# EAGLE design Switch-0.8-5.5v-ds18b20-1-4Ch (EAGLE 8.2.1)
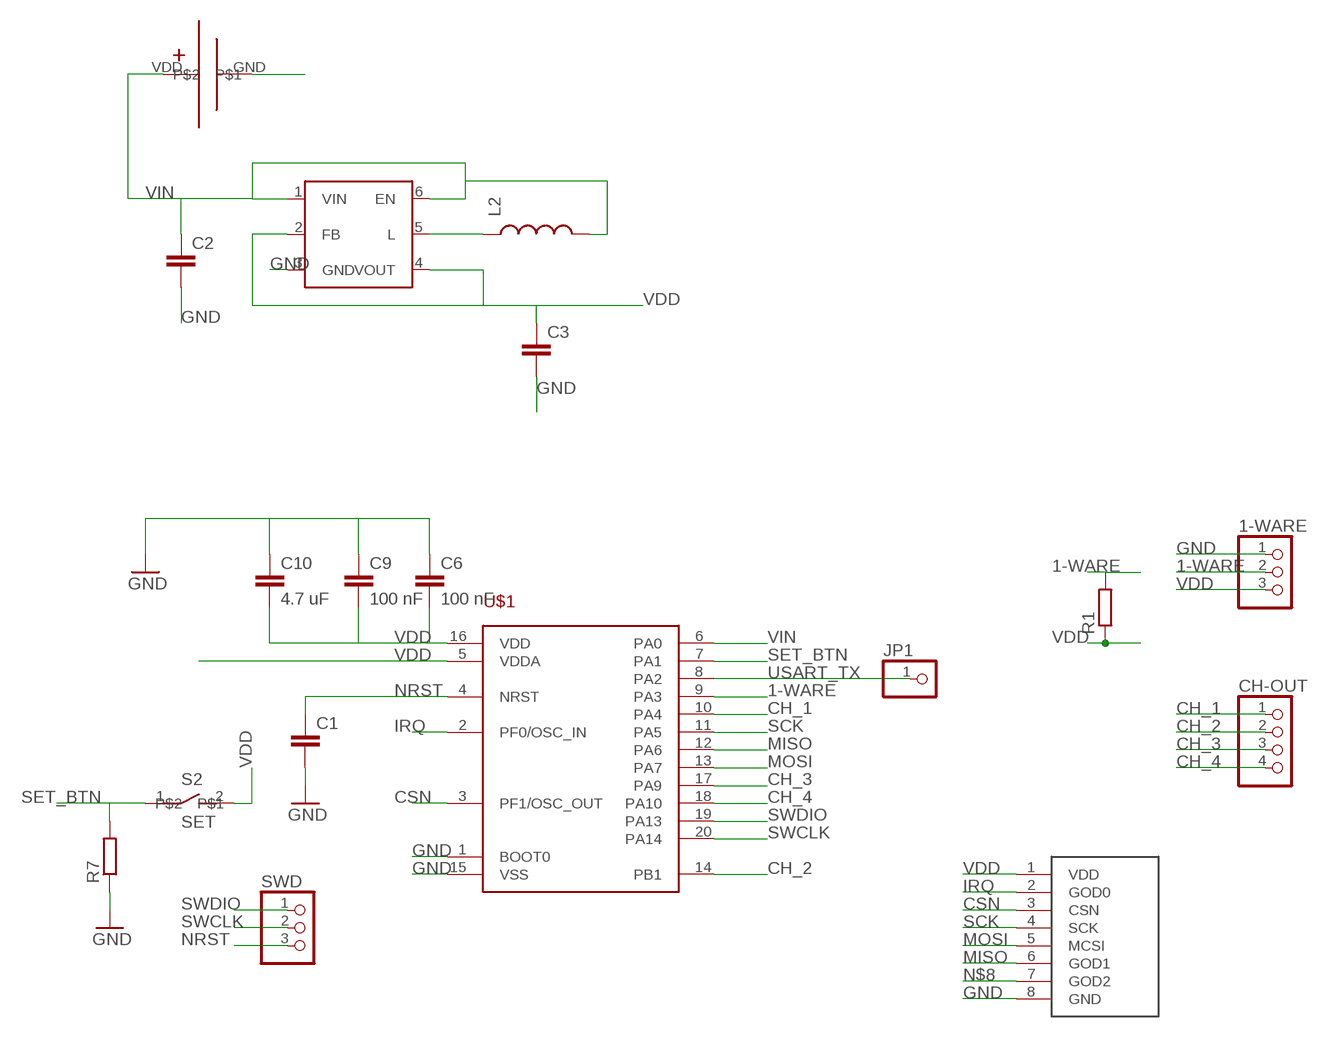
[diagram p0: schematic, sheet 1]

## Parts
1-WARE  PINHD-1X3  [1X03]
C1  C-EUC0805  [C0805]
C2  C-EUC0805  [C0805]
C3  C-EUC0805  [C0805]
C6  100 nF  C-EUC0805  [C0805]
C9  100 nF  C-EUC0805  [C0805]
C10  4.7 uF  C-EUC0805  [C0805]
CH-OUT  PINHD-1X4_2.54  [1X04]
JP1  PINHD-1X1CB  [1X01-CLEANBIG]
L2  INDUCTOR1210  [1210]
R1  R-EU_R0805  [R0805]
R7  R-EU_R0805  [R0805]
S2  SET  B3U  [1210]
SWD  PINHD-1X3CB  [1X03-CLEANBIG]
U$1  STM32F030F4  [TSSOP20]
U$2  TPS61221  TPS6122  [SC-70-6]
U$3  AS07-M1101S  [AS07-M1101S]
U$4  BAT-AA1-PCB-HOLDER  [BAT-AA1-PCB-HOLDER]

## Nets
1-WARE: 1-WARE.2 R1.2 U$1.9(PA3)
CH_1: CH-OUT.1 U$1.10(PA4)
CH_2: CH-OUT.2 U$1.14(PB1)
CH_3: CH-OUT.3 U$1.17(PA9)
CH_4: CH-OUT.4 U$1.18(PA10)
CSN: U$1.3(PF1/OSC_OUT) U$3.3(CSN)
GND: 1-WARE.1 C1.2 C2.2 C3.2 C6.1 C9.1 C10.1 R7.1 U$1.1(BOOT0) U$1.15(VSS) U$2.3(GND) U$3.8(GND) U$4.GND
IRQ: U$1.2(PF0/OSC_IN) U$3.2(GOD0)
MISO: U$1.12(PA6) U$3.6(GOD1)
MOSI: U$1.13(PA7) U$3.5(MCSI)
N$1: L2.1 U$2.5(L)
N$8: U$3.7(GOD2)
NRST: C1.1 SWD.3 U$1.4(NRST)
SCK: U$1.11(PA5) U$3.4(SCK)
SET_BTN: R7.2 S2.1 U$1.7(PA1)
SWCLK: SWD.2 U$1.20(PA14)
SWDIO: SWD.1 U$1.19(PA13)
USART_TX: JP1.1 U$1.8(PA2)
VDD: 1-WARE.3 C3.1 C6.2 C9.2 C10.2 R1.1 S2.2 U$1.5(VDDA) U$1.16(VDD) U$2.2(FB) U$2.4(VOUT) U$3.1(VDD)
VIN: C2.1 L2.2 U$1.6(PA0) U$2.1(VIN) U$2.6(EN) U$4.VDD

## Library data of the parts
1-WARE = pinhead:PINHD-1X3: PIN HEADER
C1-C3 C6 C9 C10 = resistor:C-EU: CAPACITOR, European symbol
CH-OUT = pinhead:PINHD-1X4: PIN HEADER
JP1 = adafruit:PINHD-1X1: Pin header 1x1 for 0.1" spacing With round pins
L2 = SparkFun-Passives:INDUCTOR: Inductors Basic Inductor/Choke - 0603 and 1206. Footprints are not proven and vary greatly between part numbers. INDUCTOR POWER 3.3UH 4.0A SMD 0.197" L x 0.197" W x 0.177" H (5.00mm x 5.00mm x 4.50mm)
R1 R7 = resistor:R-EU_: RESISTOR, European symbol
S2 = my_components:B3U
SWD = adafruit:PINHD-1X3: PIN HEADER
U$1 = stm32f030f4:STM32F030F4
U$2 = my_components:TPS6122
U$3 = RemoteSwitchComponents:AS07-M1101S
U$4 = RemoteSwitchComponents:BAT-AA1-PCB-HOLDER

## Board
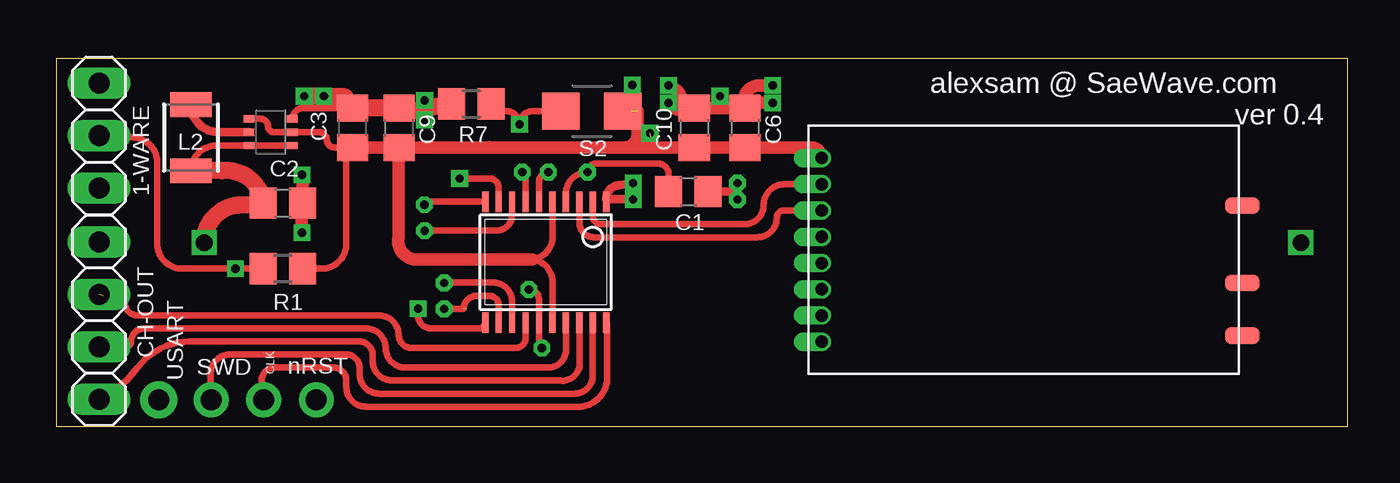
[diagram p1: board, top side]
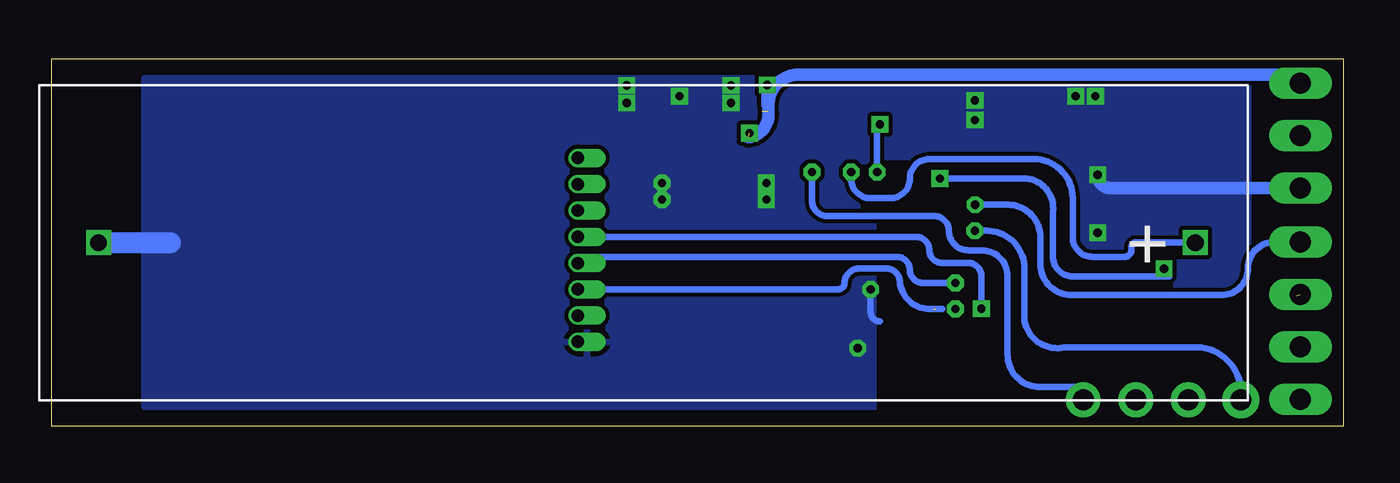
[diagram p2: board, bottom side, seen from below]

Size 62.4 x 17.77 mm. Coordinates in mm from the lower left corner, seen from the top.
Outline: 0,0 62.4,0 62.4,17.77 0,17.77 0,0
Copper layers (1*16): Top 0.035mm / dielectric 1.5mm / Bottom 0.035mm
Design rules "default *": minimum track width 10mil, minimum drill 15mil, track to track 8mil, track to pad 8mil, pad to pad 8mil, via to via 8mil, smd to smd 8mil, copper to edge 16mil, drill to drill 8mil, minimum pad ring 6mil, minimum via ring 8mil, stop-mask expansion 4mil, vias tented up to drill 25mil, thermal gap 10mil

### Footprints (pad centres in the part's own frame; a part is rotated, then mirrored left to right if it is on the bottom)
1X03 = drill 1.016 long: 1 -2.54,0; 2 0,0; 3 2.54,0
C0805 = smd 1.3 x 1.5: 1 -0.95,0; 2 0.95,0
1X04 = drill 1.016 long: 1 -3.81,0; 2 -1.27,0; 3 1.27,0; 4 3.81,0
1X01-CLEANBIG = drill 1.016 pad 1.778: 1 0,0
1210 = smd 1.2 x 2: 1 -1.6,0; 2 1.6,0
R0805 = smd 1.3 x 1.5: 1 -0.95,0; 2 0.95,0
1210' = smd 1.8 x 1.8: 1 -1.499,0; 2 1.499,0
1X03-CLEANBIG = drill 1.016 pad 1.676: 1 -2.54,0; 2 0,0; 3 2.54,0
TSSOP20 = smd 0.305 x 0.991: 1 -2.925,-2.918; 2 -2.275,-2.918; 3 -1.625,-2.918; 4 -0.975,-2.918; 5 -0.325,-2.918; 6 0.325,-2.918; 7 0.975,-2.918; 8 1.625,-2.918; 9 2.275,-2.918; 10 2.925,-2.918; 11 2.925,2.918; 12 2.275,2.918; 13 1.625,2.918; 14 0.975,2.918; 15 0.325,2.918; 16 -0.325,2.918; 17 -0.975,2.918; 18 -1.625,2.918; 19 -2.275,2.918; 20 -2.925,2.918
SC-70-6 = smd 0.35 x 0.5: 1 -0.65,-1.05; 2 0,-1.05; 3 0.65,-1.05; 4 0.65,1.05; 5 0,1.05; 6 -0.65,1.05
AS07-M1101S = drill 0.6 pad 0.85 offset: 1 -9.525,4.09; 2 -9.525,2.82; 3 -9.525,1.55; 4 -9.525,0.28; 5 -9.525,-0.99; 6 -9.525,-2.26; 7 -9.525,-3.53; 8 -9.525,-4.8 | smd 1.676 x 0.813: P$9 10.795,1.79; P$10 10.795,-1.96; P$11 10.795,-4.5
BAT-AA1-PCB-HOLDER = drill 0.8 square: GND 53,0; VDD 0,0

### Placement (x,y rotation side)
1-WARE  2.06,14.04 90 top
C1  30.54,11.34 0 top
C2  10.95,10.79 0 top
C3  14.31,14.43 90 top
C6  33.27,14.43 270 top
C9  16.55,14.43 270 top
C10  30.82,14.43 270 top
CH-OUT  2.06,5.1 270 top
JP1  4.94,1.27 0 top
L2  6.5,13.95 270 top
R1  10.95,7.62 180 top
R7  20.05,15.59 0 top
S2  SET  [1210']  25.87,15.23 0 top
SWD  10.02,1.27 0 top
U$1  23.64,7.93 180 top
U$2  10.36,14.21 90 top
U$3  46.51,8.88 0 top
U$4  7.14,8.88 180 bottom

### Tracks (layer width: path | path; a pad name or v marks a point on that pad's centre or on a via)
1-WARE  (via drill 0.4)
  Top 0.305: R1.2 v8.65,7.62 6.08,7.62 arc-90 4.87,8.82 4.87,12.74 arc90 3.64,13.97 2.13,13.97 arc-90 1-WARE.2 | U$1.9 21.37,11.54 arc90 20.94,11.97 v19.48,11.97
  Bottom 0.305: v19.48,11.97 15.28,11.97 arc90 14.02,10.38 14.02,8.2 arc-90 13.06,7.25 8.39,7.25 arc-90 v8.65,7.62
CH_1  (via drill 0.4)
  Top 0.305: U$1.10 17.92,10.85 arc90 v17.78,10.71
  Bottom 0.305: v17.78,10.71 16.2,10.71 arc90 14.63,9.13 arc-90 14.64,9.12 14.64,7.88 arc-90 13.1,6.34 5.87,6.34 arc-90 4.6,7.61 arc90 3.3,8.91 CH-OUT.1
CH_2  (1 unrouted)
  Top 0.305: U$1.14 22.67,4.25 arc-90 22.2,3.78 17.17,3.78 arc-90 16.54,4.41 arc90 15.59,5.36 3.93,5.36 arc-90 3.3,5.99 arc90 2.98,6.3 2.26,6.3
CH_3
  Top 0.305: U$1.17 24.62,3.68 arc-90 23.77,2.83 16.85,2.83 arc-90 15.91,3.78 arc90 14.96,4.72 4.24,4.72 arc90 3.61,4.09 arc-90 3.35,3.83 CH-OUT.3
CH_4
  Top 0.305: U$1.18 25.27,2.88 arc-90 24.29,2.21 16.21,2.21 arc-90 15.28,3.15 15.28,3.46 arc90 14.64,4.09 6.45,4.09 arc53 3.93,2.83 arc-27 CH-OUT.4
CSN
  Top 0.305: U$1.3 25.27,9.85 arc90 25.98,9.13 33.86,9.13 arc90 34.81,10.08 arc-90 35.16,10.43 U$3.3
GND  (via drill 0.4)
  Top 0.305: U$2.3 arc-90 11.92,15.38 C3.2 | C1.2 32.59,11.34 | U$1.1 26.57,10.98 | 27.59,10.98 arc-90 v27.87,10.96 | 23.32,3.92 U$1.15 23.32,6.12 arc90 v22.83,6.62 | C9.1 arc90 16.66,15.27 17.32,15.27 arc-90 v17.79,14.8 | v17.79,15.75 17.79,15.72 arc-90 17.3,15.23 | C10.1 30.47,15.38
  Top 0.406: 32.59,11.34 arc-90 v32.91,10.96 | C1.2 32.6,11.34 arc90 v32.91,11.76 | v27.87,11.76 27.24,11.65 arc90 26.57,10.98 27.59,10.98 | 23.32,3.92 arc90 v23.46,3.78
  Top 0.61: C10.1 C6.1 | 30.47,15.38 arc-90 v29.58,15.64 | v29.58,16.48 arc-90 30.22,15.23 31.27,15.23 | v34.62,16.48 33.95,16.48 arc90 33.22,15.75 | v34.62,15.64 33.43,15.64 arc90 33.22,15.44 | C2.2 11.9,12.12 arc90 v11.86,12.16 | v11.86,9.36 11.86,10.65 arc90 11.8,10.71
  Top 0.813: C9.1 C3.2 | R7.1 17.32,15.27 | 12.12,15.75 arc-90 12.32,15.96 v12.92,15.96 13.8,15.96 arc-90 14.01,15.75
  Bottom 0.305: v22.83,6.62 22.83,5.52 arc-90 22.38,5.07
  Bottom 0.61: 1-WARE.1 11.2,11.51 arc90 v11.86,12.16
  Bottom 1.016: U$4.GND 56.67,8.88
  other vias: 11.97,15.96 32.07,15.96
  pour Bottom: 4.58,16.82 57.94,16.82 57.94,0.94 4.58,0.94
IRQ
  Top 0.305: U$1.2 25.92,10.14 arc90 26.29,9.77 33.23,9.77 arc90 34.18,10.71 arc-90 35.17,11.7 U$3.2
MISO  (via drill 0.4)  (1 unrouted)
  Top 0.254: v18.74,5.67 arc90 v18.73,5.67
  Top 0.305: U$1.12 21.37,5.87 arc90 20.94,6.3 20.3,6.3 arc90 19.68,5.67 v18.74,5.67
  Bottom 0.305: 19.36,5.67 19.8,5.67 arc90 21.42,6.98 arc-90 22.06,7.62 23.4,7.62 arc-90 24.09,6.93 arc90 24.4,6.62 36.35,6.62
MOSI  (via drill 0.4)
  Top 0.305: U$1.13 22.02,6.04 arc90 21.11,6.95 18.75,6.95 arc90 v18.73,6.93
  Bottom 0.305: v18.73,6.93 20.31,6.93 arc90 20.94,7.56 arc-90 21.57,8.19 36.68,8.19 arc-90 36.35,7.89
N$1
  Top 0.406: U$2.5 7.83,14.21 arc-90 L2.1
N$2
  cutout Bottom: 22.38,12.69 22.38,-0.01 12.22,-0.01 12.22,5.07 14.76,5.07 14.76,12.69
NRST  (via drill 0.4)
  Top 0.305: U$1.4 24.62,11.24 arc-90 v25.66,12.29 arc-90 26.08,12.7 29.04,12.7 arc-90 29.59,12.16 C1.1
  Bottom 0.305: SWD.3 arc90 12.54,1.89 14.64,1.89 arc90 16.21,3.46 16.21,7.25 arc-90 17.47,8.51 18.1,8.51 arc90 19.05,9.45 arc-90 19.76,10.16 24.91,10.16 arc90 25.66,10.91 v25.66,12.29
SCK  (via drill 0.4)
  Top 0.305: U$1.11 arc-90 20.43,4.72 18.1,4.72 arc-90 17.47,5.36 v17.47,5.68
  Bottom 0.305: v17.47,5.68 17.47,7.25 arc-90 18.13,7.9 19.39,7.9 arc90 19.99,8.51 arc-90 20.65,9.16 36.35,9.16
SET_BTN  (via drill 0.4)
  Top 0.305: R7.2 arc90 21.04,15.23 21.75,15.23 arc-90 v22.38,14.6 arc-90 23.01,15.23 S2.1 | U$1.7 22.67,12.13 arc90 v22.51,12.29
  Bottom 0.305: v22.51,12.29 22.51,14.46 arc90 v22.38,14.6
SWCLK
  Top 0.254: 26.61,4.98 arc90 U$1.20
  Top 0.305: 26.61,4.98 26.61,2.52 arc-90 25.35,0.94 14.95,0.94 arc-90 14.01,1.89 14.01,2.21 arc90 13.38,2.83 10.54,2.83 arc90 9.91,2.21 9.91,1.38 arc90 SWD.2
SWDIO
  Top 0.305: U$1.19 25.92,2.46 arc-90 25.03,1.57 15.59,1.57 arc-90 14.65,2.52 14.65,2.83 arc90 14.01,3.46 8.38,3.46 arc90 7.45,2.54 7.45,1.29 arc90 SWD.1
USART_TX  (via drill 0.4)
  Top 0.305: U$1.8 22.02,10.21 arc-90 21.25,9.45 v17.79,9.45
  Bottom 0.305: v17.79,9.45 17.23,9.45 arc90 15.39,7.61 15.39,5.07 arc-90 13.49,3.8 6.84,3.8 arc90 JP1.1
VDD  (via drill 0.4)  (2 unrouted)
  Top 0.305: U$2.4 9.85,14.86 arc-90 10.23,14.49 arc90 10.5,14.21 U$2.2 12.71,14.21 arc-90 13.06,13.86 arc90 13.44,13.48 C3.1 arc90 14.01,13.18 14.01,8.82 arc-90 12.8,7.62 R1.1 | U$1.5 23.97,9.33 arc-90 23.01,8.07 arc-90 23.97,6.79 U$1.16 | S2.2 28.07,15.23 | 20.94,13.65 arc90 21.11,13.48
  Top 0.61: 27.46,13.48 21.11,13.48 C9.2 16.03,13.48 | 27.46,13.48 C10.2 C6.2 36.47,13.48 arc-90 U$3.1 | 16.03,13.48 C3.1 | 23.01,8.07 17.28,8.07 arc-90 16.53,9.12 16.53,12.98 arc90 16.03,13.48 | 28.07,15.23 28.07,14.1 arc-90 27.46,13.48
  Bottom 0.61: 28.73,13.97 arc-90 27.77,15.24 27.77,15.53 | 27.77,15.53 arc90 26.29,17.01 2.48,17.01 arc90 1-WARE.3 | v27.82,16.5 27.82,15.58 arc-90 27.77,15.53
  other vias: 28.68,14.18
VIN  (via drill 0.4)
  Top 0.305: U$2.1 U$2.6 7.71,13.56 arc90 L2.2 | U$1.6 23.32,11.83 arc-90 v23.77,12.29
  Top 0.813: U$4.VDD arc-90 8.97,10.71 9.47,10.71 arc90 C2.1 arc90 7.99,12.35 L2.2
  Bottom 0.305: v23.77,12.29 23.77,11.97 arc-90 22.83,11.03 21.88,11.03 arc-90 20.94,11.97 arc90 19.99,12.91 14.95,12.91 arc90 13.06,11.03 13.06,9.13 arc-90 12.12,8.19 10.54,8.19 arc-90 10.23,8.51 10.23,8.65 arc90 9.99,8.89 7.15,8.89 arc90 U$4.VDD

### Text on the board
tNames: alexsam @ SaeWave.com | ver 0.4 | CLK | nRST | USART